# EAGLE schematic AK4493-v1.64_24 (EAGLE 9.6.2)
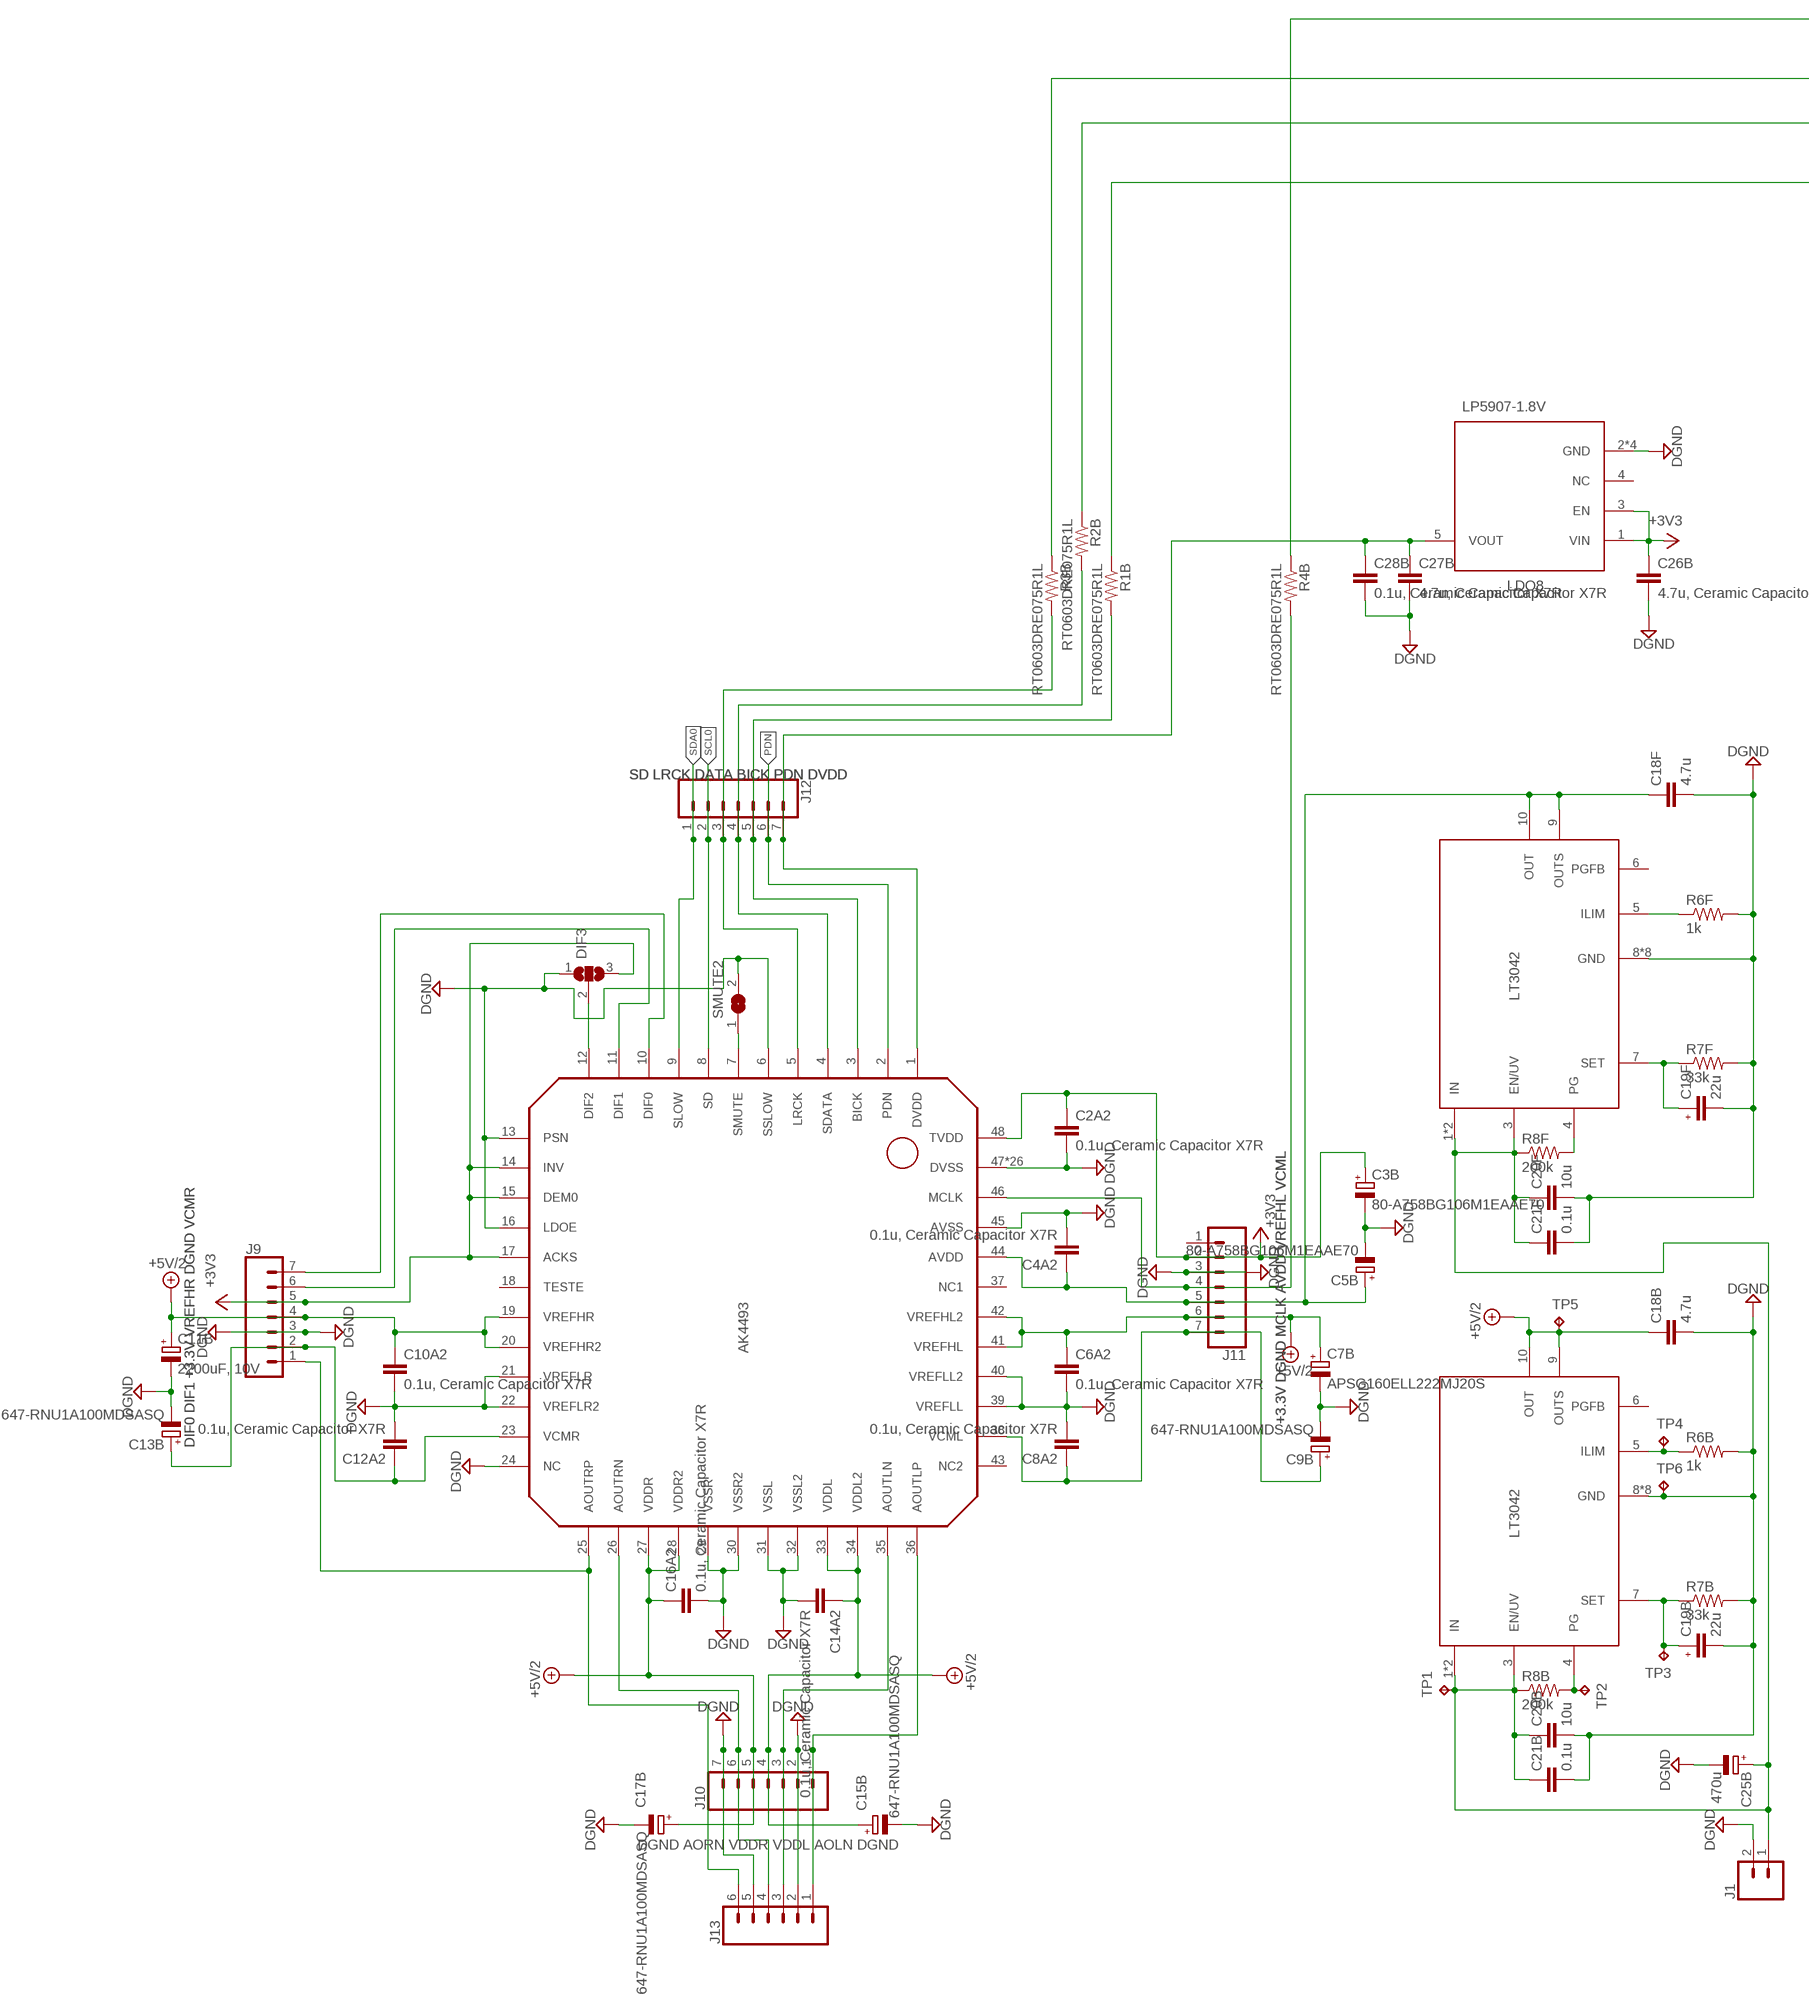
[diagram p0: schematic, sheet 1, part 1 of 2]
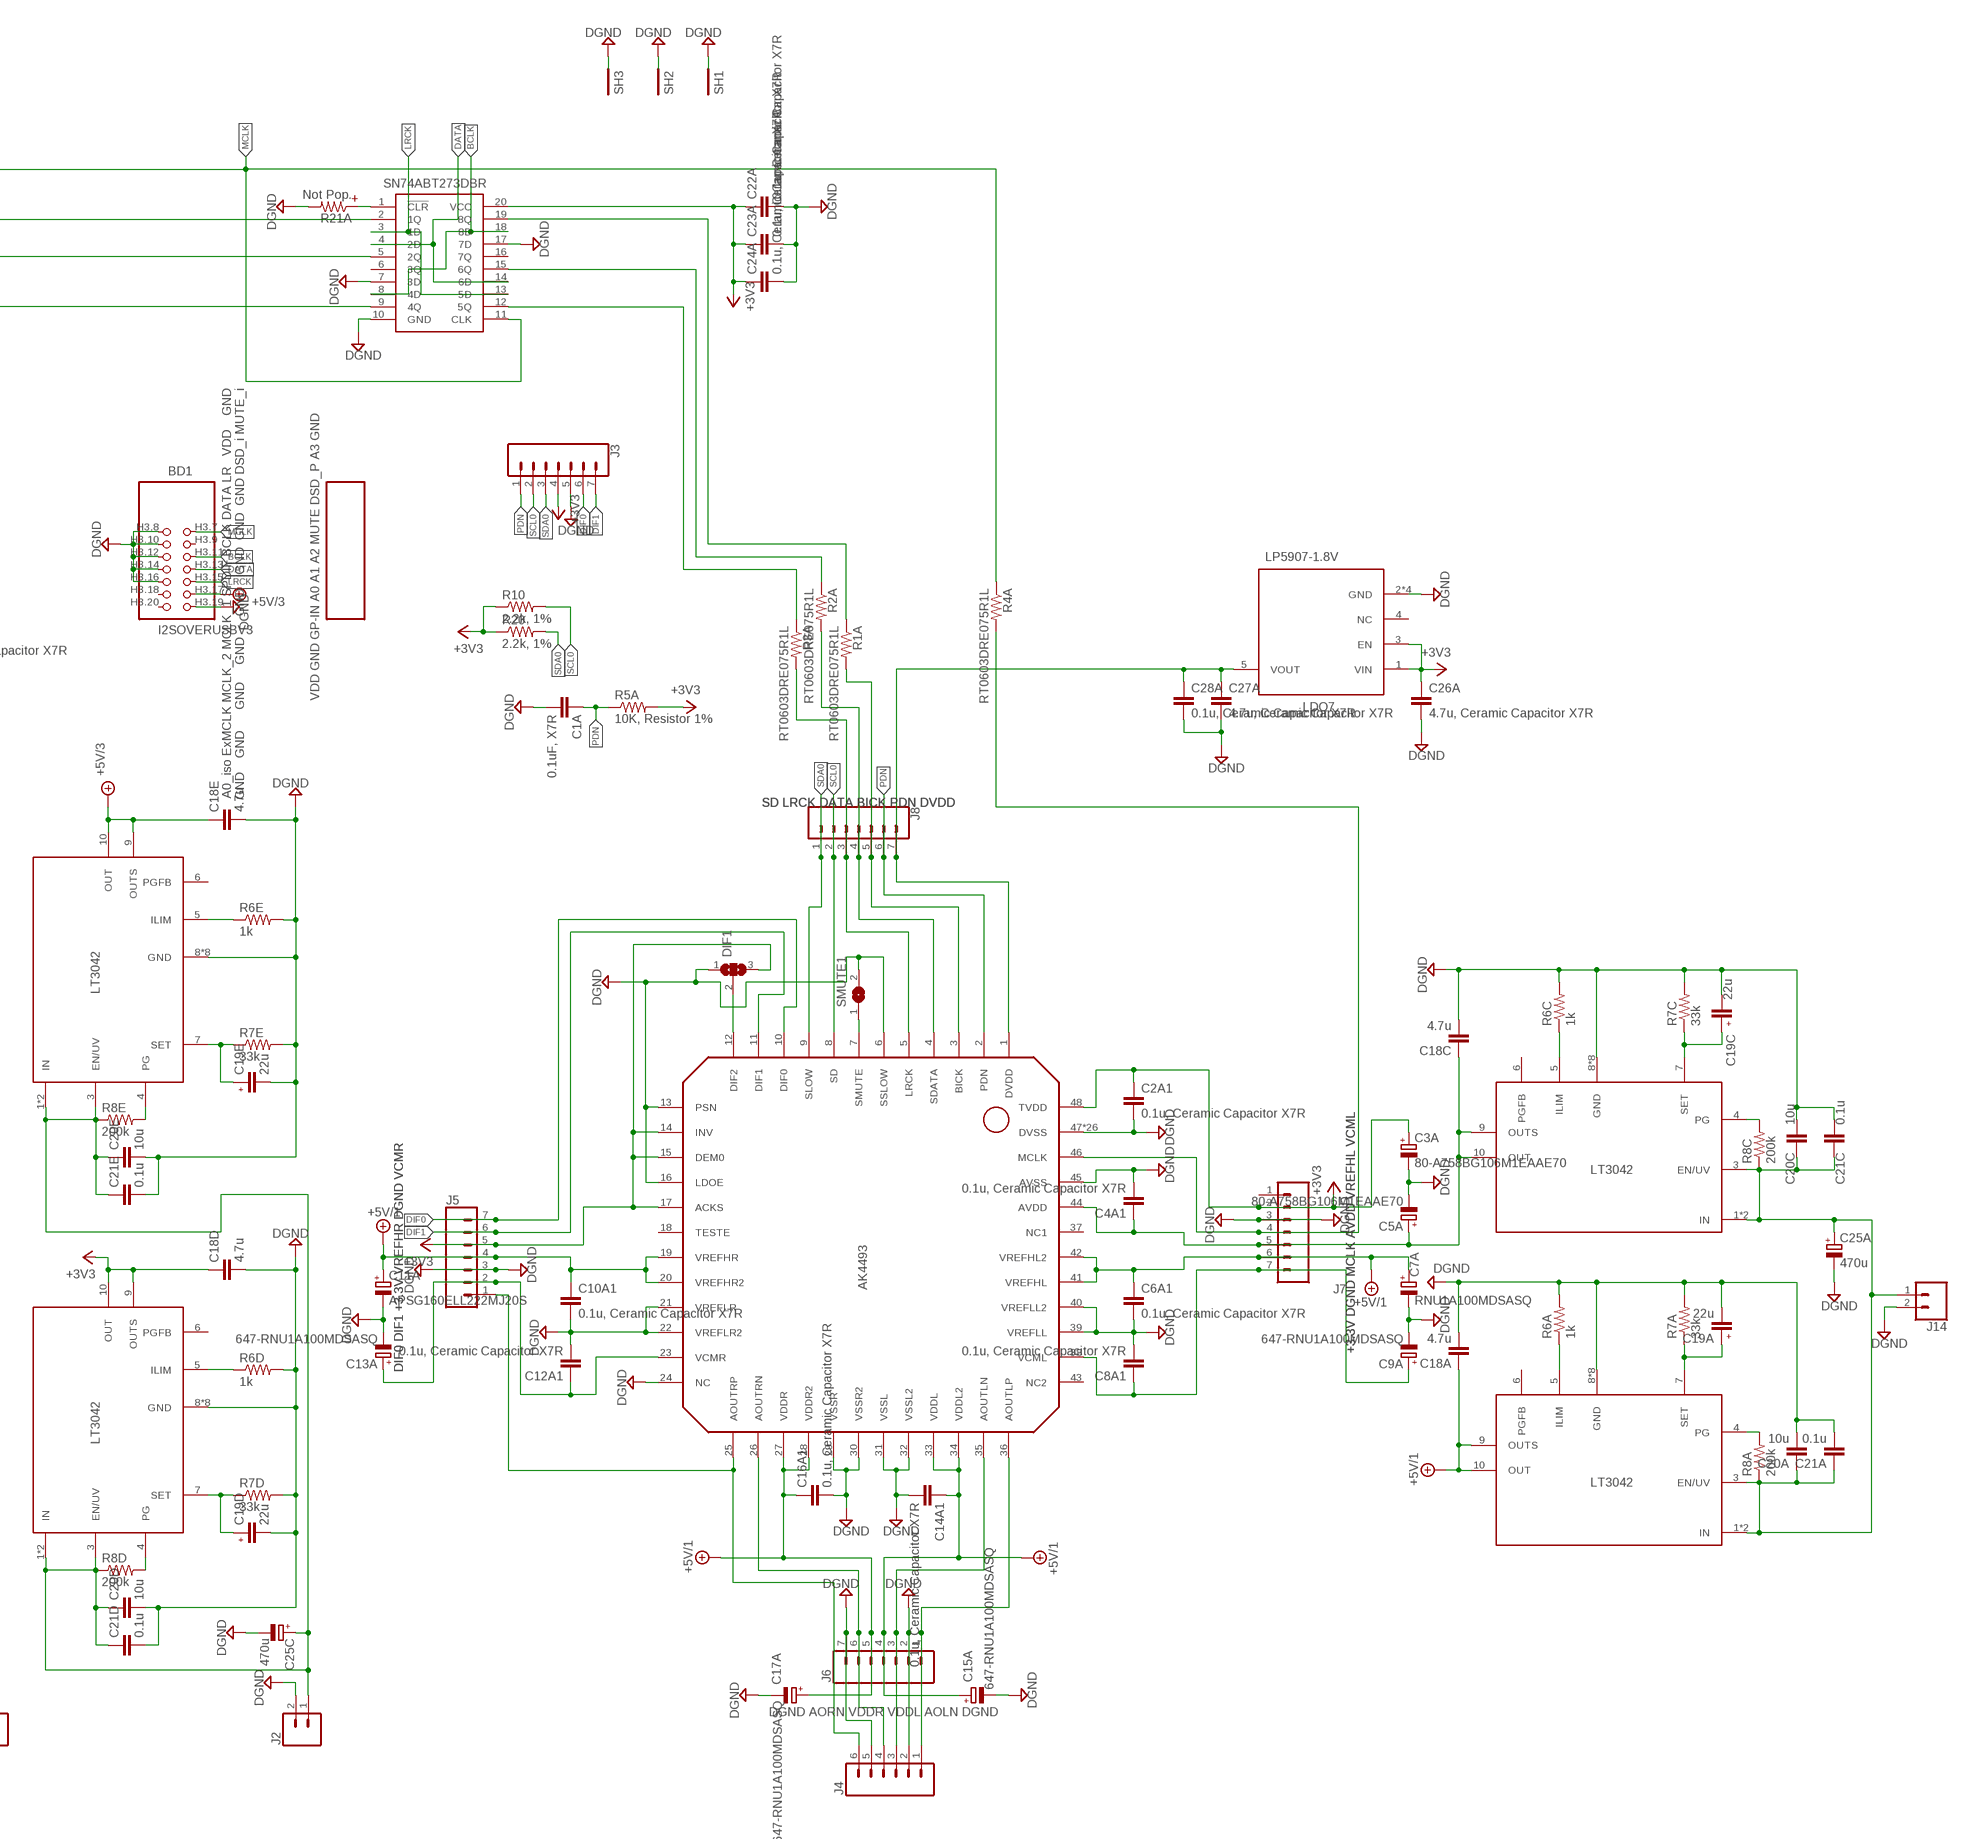
[diagram p1: schematic, sheet 1, part 2 of 2]

## Parts
BD1  I2SOVERUSBV3  [I2SOVERUSBV3]
C1A  0.1uF, X7R  EMF212B7104KGHT  [CAPC2012X135N]
C2A1  0.1u, Ceramic Capacitor X7R  EMK107B7104KA-T  [CAPC1608X95N]
C2A2  0.1u, Ceramic Capacitor X7R  EMK107B7104KA-T  [CAPC1608X95N]
C3A  80-A758BG106M1EAAE70  RNU1A100MDSASQ  [CAPPRD150W45D450H600]
C3B  80-A758BG106M1EAAE70  A758BG106M1EAAE070  [CAPPRD200W55D500H800]
C4A1  0.1u, Ceramic Capacitor X7R  EMK107B7104KA-T  [CAPC1608X95N]
C4A2  0.1u, Ceramic Capacitor X7R  EMK107B7104KA-T  [CAPC1608X95N]
C5A  80-A758BG106M1EAAE70  A758BG106M1EAAE070  [CAPPRD200W55D500H800]
C5B  80-A758BG106M1EAAE70  A758BG106M1EAAE070  [CAPPRD200W55D500H800]
C6A1  0.1u, Ceramic Capacitor X7R  EMK107B7104KA-T  [CAPC1608X95N]
C6A2  0.1u, Ceramic Capacitor X7R  EMK107B7104KA-T  [CAPC1608X95N]
C7A  RNU1A100MDSASQ  [CAPPRD150W45D450H600]
C7B  APSG160ELL222MJ20S  [CAPPRD500W60D1025H2150]
C8A1  0.1u, Ceramic Capacitor X7R  EMK107B7104KA-T  [CAPC1608X95N]
C8A2  0.1u, Ceramic Capacitor X7R  EMK107B7104KA-T  [CAPC1608X95N]
C9A  647-RNU1A100MDSASQ  RNU1A100MDSASQ  [CAPPRD150W45D450H600]
C9B  647-RNU1A100MDSASQ  RNU1A100MDSASQ  [CAPPRD150W45D450H600]
C10A1  0.1u, Ceramic Capacitor X7R  EMK107B7104KA-T  [CAPC1608X95N]
C10A2  0.1u, Ceramic Capacitor X7R  EMK107B7104KA-T  [CAPC1608X95N]
C11A  APSG160ELL222MJ20S  [CAPPRD500W60D1025H2150]
C11B  2200uF, 10V  APSG160ELL222MJ20S  [CAPPRD500W60D1025H2150]
C12A1  0.1u, Ceramic Capacitor X7R  EMK107B7104KA-T  [CAPC1608X95N]
C12A2  0.1u, Ceramic Capacitor X7R  EMK107B7104KA-T  [CAPC1608X95N]
C13A  647-RNU1A100MDSASQ  RNU1A100MDSASQ  [CAPPRD150W45D450H600]
C13B  647-RNU1A100MDSASQ  RNU1A100MDSASQ  [CAPPRD150W45D450H600]
C14A1  0.1u, Ceramic Capacitor X7R  EMK107B7104KA-T  [CAPC1608X95N]
C14A2  0.1u, Ceramic Capacitor X7R  EMK107B7104KA-T  [CAPC1608X95N]
C15A  647-RNU1A100MDSASQ  RNU1A100MDSASQ  [CAPPRD150W45D450H600]
C15B  647-RNU1A100MDSASQ  RNU1A100MDSASQ  [CAPPRD150W45D450H600]
C16A1  0.1u, Ceramic Capacitor X7R  EMK107B7104KA-T  [CAPC1608X95N]
C16A2  0.1u, Ceramic Capacitor X7R  EMK107B7104KA-T  [CAPC1608X95N]
C17A  647-RNU1A100MDSASQ  RNU1A100MDSASQ  [CAPPRD150W45D450H600]
C17B  647-RNU1A100MDSASQ  RNU1A100MDSASQ  [CAPPRD150W45D450H600]
C18A  4.7u  EMK212ABJ475KG-T  [CAPC2013X140N]
C18B  4.7u  EMK212ABJ475KG-T  [CAPC2013X140N]
C18C  4.7u  EMK212ABJ475KG-T  [CAPC2013X140N]
C18D  4.7u  EMK212ABJ475KG-T  [CAPC2013X140N]
C18E  4.7u  EMK212ABJ475KG-T  [CAPC2013X140N]
C18F  4.7u  EMK212ABJ475KG-T  [CAPC2013X140N]
C19A  22u  EMK316BB7226ML-T  [C1206]
C19B  22u  EMK316BB7226ML-T  [C1206]
C19C  22u  EMK316BB7226ML-T  [C1206]
C19D  22u  EMK316BB7226ML-T  [C1206]
C19E  22u  EMK316BB7226ML-T  [C1206]
C19F  22u  EMK316BB7226ML-T  [C1206]
C20A  10u  EMK212BB7106KG-T  [CAPC2012X135N]
C20B  10u  EMK212BB7106KG-T  [CAPC2012X135N]
C20C  10u  EMK212BB7106KG-T  [CAPC2012X135N]
C20D  10u  EMK212BB7106KG-T  [CAPC2012X135N]
C20E  10u  EMK212BB7106KG-T  [CAPC2012X135N]
C20F  10u  EMK212BB7106KG-T  [CAPC2012X135N]
C21A  0.1u  EMF212B7104KGHT  [CAPC2012X135N]
C21B  0.1u  EMF212B7104KGHT  [CAPC2012X135N]
C21C  0.1u  EMF212B7104KGHT  [CAPC2012X135N]
C21D  0.1u  EMF212B7104KGHT  [CAPC2012X135N]
C21E  0.1u  EMF212B7104KGHT  [CAPC2012X135N]
C21F  0.1u  EMF212B7104KGHT  [CAPC2012X135N]
C22A  0.1u, Ceramic Capacitor X7R  EMF212B7104KGHT  [CAPC2012X135N]
C23A  0.1u, Ceramic Capacitor X7R  EMF212B7104KGHT  [CAPC2012X135N]
C24A  0.1u, Ceramic Capacitor X7R  EMF212B7104KGHT  [CAPC2012X135N]
C25A  470u  RNE1C471MDN1  [CAPPRD350W60D825H1300]
C25B  470u  RNE1C471MDN1  [CAPPRD350W60D825H1300]
C25C  470u  RNE1C471MDN1  [CAPPRD350W60D825H1300]
C26A  4.7u, Ceramic Capacitor X7R  EMK212ABJ475KG-T  [CAPC2013X140N]
C26B  4.7u, Ceramic Capacitor X7R  EMK212ABJ475KG-T  [CAPC2013X140N]
C27A  4.7u, Ceramic Capacitor X7R  EMK212ABJ475KG-T  [CAPC2013X140N]
C27B  4.7u, Ceramic Capacitor X7R  EMK212ABJ475KG-T  [CAPC2013X140N]
C28A  0.1u, Ceramic Capacitor X7R  EMF212B7104KGHT  [CAPC2012X135N]
C28B  0.1u, Ceramic Capacitor X7R  EMF212B7104KGHT  [CAPC2012X135N]
DIF1  SJ2W  [SJ_2]
DIF3  SJ2W  [SJ_2]
IC2  AK4493  [LQFP48_]
IC3  AK4493  [LQFP48_]
IC4A  SN74ABT273DBR  [SOP65P780X200-20N]
J1  CONN_02  [1X02]
J2  CONN_02  [1X02]
J3  CONN_07  [1X07]
J4  CONN_06SILK_FEMALE_PTH  [1X06]
J5  CONN_07  [1X07]
J6  CONN_07  [1X07]
J7  CONN_07  [1X07]
J8  CONN_07  [1X07]
J9  CONN_07  [1X07]
J10  CONN_07  [1X07]
J11  CONN_07  [1X07]
J12  CONN_07  [1X07]
J13  CONN_06SILK_FEMALE_PTH  [1X06]
J14  CONN_02  [1X02]
LDO1  LT3042  [SOP50P490X110-11N]
LDO2  LT3042  [SOP50P490X110-11N]
LDO3  LT3042  [SOP50P490X110-11N]
LDO4  LT3042  [SOP50P490X110-11N]
LDO5  LT3042  [SOP50P490X110-11N]
LDO6  LT3042  [SOP50P490X110-11N]
LDO7  LP5907-1.8V  [SOT95P280X145-5N]
LDO8  LP5907-1.8V  [SOT95P280X145-5N]
R1A  RT0603DRE075R1L  [RESC1608X55N]
R1B  RT0603DRE075R1L  [RESC1608X55N]
R2A  RT0603DRE075R1L  [RESC1608X55N]
R2B  RT0603DRE075R1L  [RESC1608X55N]
R3A  RT0603DRE075R1L  [RESC1608X55N]
R3B  RT0603DRE075R1L  [RESC1608X55N]
R4A  RT0603DRE075R1L  [RESC1608X55N]
R4B  RT0603DRE075R1L  [RESC1608X55N]
R5A  10K, Resistor 1%  RCS080510K0FKEA  [RESC2012X50N]
R6A  1k  CHP0805-FX-1001ELF  [RESC2012X60N]
R6B  1k  CHP0805-FX-1001ELF  [RESC2012X60N]
R6C  1k  CHP0805-FX-1001ELF  [RESC2012X60N]
R6D  1k  CHP0805-FX-1001ELF  [RESC2012X60N]
R6E  1k  CHP0805-FX-1001ELF  [RESC2012X60N]
R6F  1k  CHP0805-FX-1001ELF  [RESC2012X60N]
R7A  33k  CPF0805B51KE1  [R0805]
R7B  33k  CPF0805B51KE1  [R0805]
R7C  33k  CPF0805B51KE1  [R0805]
R7D  33k  CPF0805B51KE1  [R0805]
R7E  33k  CPF0805B51KE1  [R0805]
R7F  33k  CPF0805B51KE1  [R0805]
R8A  200k  RR1220P-204-D  [R0805]
R8B  200k  RR1220P-204-D  [R0805]
R8C  200k  RR1220P-204-D  [R0805]
R8D  200k  RR1220P-204-D  [R0805]
R8E  200k  RR1220P-204-D  [R0805]
R8F  200k  RR1220P-204-D  [R0805]
R10  2.2k, 1%  RCS08052K20FKEA  [RCS0805_E3]
R20  2.2k, 1%  RCS08052K20FKEA  [RCS0805_E3]
R21A  Not Pop.  R-POLR0805  [R0805-POL]
SH1  SHORTA5  [SHORT_ALL-50]
SH2  SHORTA5  [SHORT_ALL-50]
SH3  SHORTA5  [SHORT_ALL-50]
SMUTE1  SJ  [SJ]
SMUTE2  SJ  [SJ]
TP1  TPB1,27  [B1,27]
TP2  TPB1,27  [B1,27]
TP3  TPB1,27  [B1,27]
TP4  TPB1,27  [B1,27]
TP5  TPB1,27  [B1,27]
TP6  TPB1,27  [B1,27]

## Nets
+3V3: C2A1.1 C2A2.1 C3A.1(+) C3B.1(+) C18D.1 C22A.1 C23A.1 C24A.1 C26A.1 C26B.1 DIF1.3 DIF3.3 IC2.14(INV) IC2.15(DEM0) IC2.17(ACKS) IC2.48(TVDD) IC3.14(INV) IC3.15(DEM0) IC3.17(ACKS) IC3.48(TVDD) IC4A.20(VCC) J3.4 J5.5 J7.2 J9.5 J11.2 LDO4.9(OUTS) LDO4.10(OUT) LDO7.1(VIN) LDO7.3(EN) LDO8.1(VIN) LDO8.3(EN) R5A.2 R10.1 R20.1
+5V/1: C6A1.1 C7A.1(+) C10A1.1 C11A.1(+) C14A1.1 C15A.1(+) C16A1.1 C17A.1(+) C18A.1 IC2.19(VREFHR) IC2.20(VREFHR2) IC2.27(VDDR) IC2.28(VDDR2) IC2.33(VDDL) IC2.34(VDDL2) IC2.41(VREFHL) IC2.42(VREFHL2) J5.4 J6.4 J6.5 J7.6 LDO1.9(OUTS) LDO1.10(OUT)
+5V/2: C6A2.1 C7B.1(+) C10A2.1 C11B.1(+) C14A2.1 C15B.1(+) C16A2.1 C17B.1(+) C18B.1 IC3.19(VREFHR) IC3.20(VREFHR2) IC3.27(VDDR) IC3.28(VDDR2) IC3.33(VDDL) IC3.34(VDDL2) IC3.41(VREFHL) IC3.42(VREFHL2) J9.4 J10.4 J10.5 J11.6 LDO2.9(OUTS) LDO2.10(OUT) TP5.TP
+5V/3: BD1.H3.17 C18E.1 LDO5.9(OUTS) LDO5.10(OUT)
BCLK: BD1.H3.11 IC4A.8(4D) IC4A.18(8D)
DATA: BD1.H3.13 IC4A.4(2D) IC4A.14(6D)
DGND: BD1.H3.8 BD1.H3.10 BD1.H3.12 BD1.H3.14 BD1.H3.16 BD1.H3.19 C1A.2 C2A1.2 C2A2.2 C3A.2(-) C3B.2(-) C4A1.2 C4A2.2 C5A.2(-) C5B.2(-) C6A1.2 C6A2.2 C7A.2(-) C7B.2(-) C8A1.2 C8A2.2 C9A.2(-) C9B.2(-) C10A1.2 C10A2.2 C11A.2(-) C11B.2(-) C12A1.2 C12A2.2 C13A.2(-) C13B.2(-) C14A1.2 C14A2.2 C15A.2(-) C15B.2(-) C16A1.2 C16A2.2 C17A.2(-) C17B.2(-) C18A.2 C18B.2 C18C.2 C18D.2 C18E.2 C18F.2 C19A.2 C19A.DGND C19B.2 C19B.DGND C19C.2 C19C.DGND C19D.2 C19D.DGND C19E.2 C19E.DGND C19F.2 C19F.DGND C20A.2 C20B.2 C20C.2 C20D.2 C20E.2 C20F.2 C21A.2 C21B.2 C21C.2 C21D.2 C21E.2 C21F.2 C22A.2 C23A.2 C24A.2 C25A.2(-) C25B.2(-) C25C.2(-) C26A.2 C26B.2 C27A.2 C27B.2 C28A.2 C28B.2 DIF1.1 DIF3.1 IC2.6(SSLOW) IC2.13(PSN) IC2.16(LDOE) IC2.21(VREFLR) IC2.22(VREFLR2) IC2.24(NC) IC2.29(VSSR) IC2.30(VSSR2) IC2.31(VSSL) IC2.32(VSSL2) IC2.39(VREFLL) IC2.40(VREFLL2) IC2.45(AVSS) IC2.47(DVSS) IC2.P$1(DVSS) IC2.P$2(DVSS) IC2.P$3(DVSS) IC2.P$4(DVSS) IC2.P$5(DVSS) IC2.P$6(DVSS) IC2.P$7(DVSS) IC2.P$8(DVSS) IC2.P$9(DVSS) IC2.P$10(DVSS) IC2.P$11(DVSS) IC2.P$12(DVSS) IC2.P$13(DVSS) IC2.P$14(DVSS) IC2.P$15(DVSS) IC2.P$16(DVSS) IC2.P$17(DVSS) IC2.P$18(DVSS) IC2.P$19(DVSS) IC2.P$20(DVSS) IC2.P$21(DVSS) IC2.P$22(DVSS) IC2.P$23(DVSS) IC2.P$24(DVSS) IC2.P$25(DVSS) IC3.6(SSLOW) IC3.13(PSN) IC3.16(LDOE) IC3.21(VREFLR) IC3.22(VREFLR2) IC3.24(NC) IC3.29(VSSR) IC3.30(VSSR2) IC3.31(VSSL) IC3.32(VSSL2) IC3.39(VREFLL) IC3.40(VREFLL2) IC3.45(AVSS) IC3.47(DVSS) IC3.P$1(DVSS) IC3.P$2(DVSS) IC3.P$3(DVSS) IC3.P$4(DVSS) IC3.P$5(DVSS) IC3.P$6(DVSS) IC3.P$7(DVSS) IC3.P$8(DVSS) IC3.P$9(DVSS) IC3.P$10(DVSS) IC3.P$11(DVSS) IC3.P$12(DVSS) IC3.P$13(DVSS) IC3.P$14(DVSS) IC3.P$15(DVSS) IC3.P$16(DVSS) IC3.P$17(DVSS) IC3.P$18(DVSS) IC3.P$19(DVSS) IC3.P$20(DVSS) IC3.P$21(DVSS) IC3.P$22(DVSS) IC3.P$23(DVSS) IC3.P$24(DVSS) IC3.P$25(DVSS) IC4A.7(3D) IC4A.10(GND) IC4A.17(7D) J1.2 J2.2 J3.5 J4.2 J4.5 J5.3 J6.2 J6.7 J7.3 J9.3 J10.2 J10.7 J11.3 J13.2 J13.5 J14.2 LDO1.8(GND) LDO1.11(GND) LDO1.P$1(GND) LDO1.P$2(GND) LDO1.P$3(GND) LDO1.P$4(GND) LDO1.P$5(GND) LDO1.P$6(GND) LDO2.8(GND) LDO2.11(GND) LDO2.P$1(GND) LDO2.P$2(GND) LDO2.P$3(GND) LDO2.P$4(GND) LDO2.P$5(GND) LDO2.P$6(GND) LDO3.8(GND) LDO3.11(GND) LDO3.P$1(GND) LDO3.P$2(GND) LDO3.P$3(GND) LDO3.P$4(GND) LDO3.P$5(GND) LDO3.P$6(GND) LDO4.8(GND) LDO4.11(GND) LDO4.P$1(GND) LDO4.P$2(GND) LDO4.P$3(GND) LDO4.P$4(GND) LDO4.P$5(GND) LDO4.P$6(GND) LDO5.8(GND) LDO5.11(GND) LDO5.P$1(GND) LDO5.P$2(GND) LDO5.P$3(GND) LDO5.P$4(GND) LDO5.P$5(GND) LDO5.P$6(GND) LDO6.8(GND) LDO6.11(GND) LDO6.P$1(GND) LDO6.P$2(GND) LDO6.P$3(GND) LDO6.P$4(GND) LDO6.P$5(GND) LDO6.P$6(GND) LDO7.2(GND) LDO7.DGND2(GND) LDO7.DGND3(GND) LDO7.DGND(GND) LDO8.2(GND) LDO8.DGND2(GND) LDO8.DGND3(GND) LDO8.DGND(GND) R6A.2 R6B.2 R6C.2 R6D.2 R6E.2 R6F.2 R7A.2 R7B.2 R7C.2 R7D.2 R7E.2 R7F.2 R21A.2 R21A.DGND SH1.1 SH2.1 SH3.1 SMUTE1.2 SMUTE2.2 TP6.TP
DIF0: IC2.10(DIF0) J3.6 J5.7
DIF1: IC2.11(DIF1) J3.7 J5.6
LRCK: BD1.H3.15 IC4A.3(1D) IC4A.13(5D)
MCLK: BD1.H3.7 IC4A.11(CLK) R4A.1 R4B.1
N$1: IC4A.1(!CLR) R21A.1
N$2: C8A2.1 C9B.1(+) IC3.38(VCML) J11.7
N$4: C4A1.1 C5A.1(+) C18C.1 IC2.44(AVDD) J7.5 LDO3.9(OUTS) LDO3.10(OUT)
N$5: LDO3.5(ILIM) R6C.1
N$6: LDO4.5(ILIM) R6D.1
N$7: C19D.1 LDO4.7(SET) R7D.1
N$8: LDO4.4(PG) R8D.2
N$9: LDO5.5(ILIM) R6E.1
N$10: C19E.1 LDO5.7(SET) R7E.1
N$11: IC3.46(MCLK) J11.4 R4B.2
N$13: LDO5.4(PG) R8E.2
N$14: C20D.1 C20E.1 C21D.1 C21E.1 C25C.1(+) J2.1 LDO4.1(IN) LDO4.2(IN) LDO4.3(EN/UV) LDO5.1(IN) LDO5.2(IN) LDO5.3(EN/UV) R8D.1 R8E.1
N$15: LDO1.5(ILIM) R6A.1
N$19: IC2.5(LRCK) J8.3 R3A.2
N$20: IC2.4(SDATA) J8.4 R2A.2
N$21: IC2.3(BICK) J8.5 R1A.2
N$22: C19A.1 LDO1.7(SET) R7A.1
N$23: IC4A.19(8Q) R1A.1
N$24: IC4A.15(6Q) R2A.1
N$25: IC4A.12(5Q) R3A.1
N$26 [R_Audio]: IC2.26(AOUTRN) J4.4 J6.6
N$27: IC3.3(BICK) J12.5 R1B.2
N$28: IC3.4(SDATA) J12.4 R2B.2
N$29: IC3.5(LRCK) J12.3 R3B.2
N$30: IC4A.9(4Q) R1B.1
N$31: IC4A.5(2Q) R2B.1
N$32: IC4A.2(1Q) R3B.1
N$33: LDO1.4(PG) R8A.2
N$35: LDO6.5(ILIM) R6F.1
N$36: C19F.1 LDO6.7(SET) R7F.1
N$37: C27A.1 C28A.1 IC2.1(DVDD) J8.7 LDO7.5(VOUT)
N$39: LDO6.4(PG) R8F.2
N$40: C20A.1 C20C.1 C21A.1 C21C.1 C25A.1(+) J14.1 LDO1.1(IN) LDO1.2(IN) LDO1.3(EN/UV) LDO3.1(IN) LDO3.2(IN) LDO3.3(EN/UV) R8A.1 R8C.1
N$42: C4A2.1 C5B.1(+) C18F.1 IC3.44(AVDD) J11.5 LDO6.9(OUTS) LDO6.10(OUT)
N$43: C19C.1 LDO3.7(SET) R7C.1
N$44: LDO3.4(PG) R8C.2
N$48: LDO2.5(ILIM) R6B.1 TP4.TP
N$49: C19B.1 LDO2.7(SET) R7B.1 TP3.TP
N$50: LDO2.4(PG) R8B.2 TP2.TP
N$51: C20B.1 C20F.1 C21B.1 C21F.1 C25B.1(+) J1.1 LDO2.1(IN) LDO2.2(IN) LDO2.3(EN/UV) LDO6.1(IN) LDO6.2(IN) LDO6.3(EN/UV) R8B.1 R8F.1 TP1.TP
N$66: C27B.1 C28B.1 IC3.1(DVDD) J12.7 LDO8.5(VOUT)
N$69: C12A1.1 C13A.1(+) IC2.23(VCMR) J5.2
N$79: IC3.36(AOUTLP) J10.1 J13.1
N$80: IC3.25(AOUTRP) J9.1 J13.6
N$81: IC3.10(DIF0) J9.7
N$82 [L_Audio]: IC2.36(AOUTLP) J4.1 J6.1
N$83 [L_Audio]: IC2.35(AOUTLN) J4.3 J6.3
N$87: IC3.35(AOUTLN) J10.3 J13.3
N$88: IC3.26(AOUTRN) J10.6 J13.4
N$90: IC2.25(AOUTRP) J4.6 J5.1
N$96: IC2.46(MCLK) J7.4 R4A.2
N$101: C12A2.1 C13B.1(+) IC3.23(VCMR) J9.2
N$102: C8A1.1 C9A.1(+) IC2.38(VCML) J7.7
N$105: DIF1.2 IC2.12(DIF2)
N$106: IC2.7(SMUTE) SMUTE1.1
N$107: DIF3.2 IC3.12(DIF2)
N$114: IC3.7(SMUTE) SMUTE2.1
N$116: IC3.11(DIF1) J9.6
PDN: C1A.1 IC2.2(PDN) IC3.2(PDN) J3.1 J8.6 J12.6 R5A.1
SCL0: IC2.8(SD) IC3.8(SD) J3.2 J8.2 J12.2 R10.2
SDA0: IC2.9(SLOW) IC3.9(SLOW) J3.3 J8.1 J12.1 R20.2
Unconnected: BD1.H3.9 BD1.H3.18 BD1.H3.20 IC2.18(TESTE) IC2.37(NC1) IC2.43(NC2) IC3.18(TESTE) IC3.37(NC1) IC3.43(NC2) IC4A.6(3Q) IC4A.16(7Q) J7.1 J11.1 LDO1.6(PGFB) LDO2.6(PGFB) LDO3.6(PGFB) LDO4.6(PGFB) LDO5.6(PGFB) LDO6.6(PGFB) LDO7.4(NC) LDO8.4(NC) SH1.2 SH2.2 SH3.2

## Notes on the sheet
- SD LRCK DATA BICK PDN DVDD | SD LRCK DATA BICK PDN DVDD | SD LRCK DATA BICK PDN DVDD | SD LRCK DATA BICK PDN DVDD
- +3.3V DGND MCLK AVDD VREFHL VCML | +3.3V DGND MCLK AVDD VREFHL VCML | +3.3V DGND MCLK AVDD VREFHL VCML | +3.3V DGND MCLK AVDD VREFHL VCML
- DIF0 DIF1 +3.3V VREFHR DGND VCMR | DIF0 DIF1 +3.3V VREFHR DGND VCMR | DIF0 DIF1 +3.3V VREFHR DGND VCMR | DIF0 DIF1 +3.3V VREFHR DGND VCMR
- DGND AORN VDDR VDDL AOLN DGND
- DGND AORN VDDR VDDL AOLN DGND

## Library data of the parts
BD1 = Dual Mono Amp Library:I2SOVERUSBV3: Asynchronous audio transfer at sampling rates up to 768 kHz and 32 bit; BOM: Yes; DESCRIPTION: Asynchronous audio transfer at sampling rates up to 768 kHz and 32 bit
C1A C21A C21B C21C C21D C21E C21F C22A C23A C24A C28A C28B = Dual Mono Amp Library:EMF212B7104KGHT: Multilayer Ceramic Capacitors MLCC - SMD/SMT 0805 16VDC 0.1uF 10% X7R AEC-Q200 Source: Datasheet <https://www.mouser.sg/ProductDetail/Taiyo-Yuden/EMF212B7104KGHT?qs=sGAEpiMZZMsh%2B1woXyUXj3/0vCYPokIk61QdMFnXOfA=>; DESCRIPTION: Multilayer Ceramic Capacitors MLCC - SMD/SMT 0805 16VDC 0.1uF 10% X7R AEC-Q200; HEIGHT: 1.35mm; MANUFACTURER_NAME: TAIYO YUDEN; MANUFACTURER_PART_NUMBER: EMF212B7104KGHT; MOUSER_PART_NUMBER: 963-EMF212B7104KGHT; MOUSER_PRICE-STOCK: https://www.mouser.co.uk/ProductDetail/Taiyo-Yuden/EMF212B7104KGHT?qs=%252B6g0mu59x7JRGtoE3odDgw%3D%3D
C2A1 C2A2 C4A1 C4A2 C6A1 C6A2 C8A1 C8A2 C10A1 C10A2 C12A1 C12A2 C14A1 C14A2 C16A1 C16A2 = Dual Mono Amp Library:EMK107B7104KA-T: EMK107B7104KA-T 0.1F +/-10% 16V Ceramic Capacitor X7R 0603 Source: Datasheet; DESCRIPTION: EMK107B7104KA-T 0.1F +/-10% 16V Ceramic Capacitor X7R 0603; HEIGHT: 0.95mm; MANUFACTURER_NAME: TAIYO YUDEN; MANUFACTURER_PART_NUMBER: EMK107B7104KA-T; MOUSER_PART_NUMBER: 963-EMK107B7104KA-T; MOUSER_PRICE-STOCK: https://www.mouser.co.uk/ProductDetail/TAIYO-YUDEN/EMK107B7104KA-T?qs=I6KAKw0tg2ybqzX8hKPgfw%3D%3D
C3A C7A C9A C9B C13A C13B C15A C15B C17A C17B = Dual Mono Amp Library:RNU1A100MDSASQ: Aluminum Organic Polymer Capacitors 10 Volt 10uF 20% Source: Datasheet <https://www.nichicon.co.jp/products/pdfs/f_nu.pdf>; DESCRIPTION: Aluminum Organic Polymer Capacitors 10 Volt 10uF 20%; HEIGHT: 6mm; MANUFACTURER_NAME: Nichicon; MANUFACTURER_PART_NUMBER: RNU1A100MDSASQ; MOUSER_PART_NUMBER: 647-RNU1A100MDSASQ; MOUSER_PRICE-STOCK: https://www.mouser.co.uk/ProductDetail/Nichicon/RNU1A100MDSASQ?qs=eL6fcoQH66Plszdei%2FxZtw%3D%3D
C3B C5A C5B = Dual Mono Amp Library:A758BG106M1EAAE070: A758, Aluminum, Polymer Aluminum, 10 uF, 20%, 25 VDC, -55/+105C, 105C, -55C, 105C, 5,000 Hrs, 10 % , 70 mOhms, 120 uA, 5mm, 7mm, Lead Spacing = 2mm, 19mm, 1000 Source: Datasheet <https://content.kemet.com/datasheets/KEM_A4069_A758.pdf>; DESCRIPTION: A758, Aluminum, Polymer Aluminum, 10 uF, 20%, 25 VDC, -55/+105C, 105C, -55C, 105C, 5,000 Hrs, 10 % , 70 mOhms, 120 uA, 5mm, 7mm, Lead Spacing = 2mm, 19mm, 1000; HEIGHT: 8mm; MANUFACTURER_NAME: KEMET; MANUFACTURER_PART_NUMBER: A758BG106M1EAAE070; MOUSER_PART_NUMBER: 80-A758BG106M1EAAE70; MOUSER_PRICE-STOCK: https://www.mouser.co.uk/ProductDetail/KEMET/A758BG106M1EAAE070?qs=M6jHmRuQorU1WkHVIs6y3Q%3D%3D
C7B C11A C11B = Dual Mono Amp Library:APSG160ELL222MJ20S: Aluminum Organic Polymer Capacitors 16V 2200uF 20% Tol. Source: Datasheet <https://www.chemi-con.co.jp/products/relatedfiles/capacitor/catalog/PSGLL-e.PDF>; DESCRIPTION: Aluminum Organic Polymer Capacitors 16V 2200uF 20% Tol.; HEIGHT: 21.5mm; MANUFACTURER_NAME: Chemi-Con; MANUFACTURER_PART_NUMBER: APSG160ELL222MJ20S; MOUSER_PART_NUMBER: 661-APSG160E222MJ20S; MOUSER_PRICE-STOCK: https://www.mouser.co.uk/ProductDetail/United-Chemi-Con/APSG160ELL222MJ20S?qs=nxZbHzLpdvcUAIXRVD5aZg%3D%3D
C18A C18B C18C C18D C18E C18F C26A C26B C27A C27B = Dual Mono Amp Library:EMK212ABJ475KG-T: Taiyo Yuden 4.7uF Multilayer Ceramic Capacitor MLCC 16V dc +/-10% X5R Dielectric 0805 SMD, Max. Temp. +85C Source: Datasheet <https://datasheet.datasheetarchive.com/originals/distributors/DKDS-8/141347.pdf>; DESCRIPTION: Taiyo Yuden 4.7uF Multilayer Ceramic Capacitor MLCC 16V dc +/-10% X5R Dielectric 0805 SMD, Max. Temp. +85C; HEIGHT: 1.4mm; MANUFACTURER_NAME: TAIYO YUDEN; MANUFACTURER_PART_NUMBER: EMK212ABJ475KG-T; MOUSER_PART_NUMBER: 963-EMK212ABJ475KG-T; MOUSER_PRICE-STOCK: https://www.mouser.co.uk/ProductDetail/Taiyo-Yuden/EMK212ABJ475KG-T?qs=Va%252BXcMGJzEtDqSLhA2RQmA%3D%3D
C19A C19B C19C C19D C19E C19F = Dual Mono Amp Library:EMK316BB7226ML-T: Multilayer Ceramic Capacitors MLCC - SMD/SMT 22uF 16V X7R +/-20% 1206 Gen Purp Source: Datasheet <https://componentsearchengine.com/Datasheets/1/EMK316BB7226ML-T.pdf>; DESCRIPTION: Multilayer Ceramic Capacitors MLCC - SMD/SMT 22uF 16V X7R +/-20% 1206 Gen Purp; HEIGHT: 1.8mm; MANUFACTURER_NAME: TAIYO YUDEN; MANUFACTURER_PART_NUMBER: EMK316BB7226ML-T; MOUSER_PART_NUMBER: 963-EMK316BB7226ML-T; MOUSER_PRICE-STOCK: https://www.mouser.co.uk/ProductDetail/TAIYO-YUDEN/EMK316BB7226ML-T?qs=EPmvyOv1YlPvyo1ebMxtFg%3D%3D
C20A C20B C20C C20D C20E C20F = Dual Mono Amp Library:EMK212BB7106KG-T: Multilayer Ceramic Capacitors MLCC - SMD/SMT 10uF 16V X7R 10% 0805 Source: Datasheet; DESCRIPTION: Multilayer Ceramic Capacitors MLCC - SMD/SMT 10uF 16V X7R 10% 0805; HEIGHT: 1.35mm; MANUFACTURER_NAME: TAIYO YUDEN; MANUFACTURER_PART_NUMBER: EMK212BB7106KG-T; MOUSER_PART_NUMBER: 963-EMK212BB7106KG-T; MOUSER_PRICE-STOCK: https://www.mouser.co.uk/ProductDetail/TAIYO-YUDEN/EMK212BB7106KG-T?qs=vF%252B8ahGVilemLVRka0hELA%3D%3D
C25A C25B C25C = Dual Mono Amp Library:RNE1C471MDN1: Cap Aluminum Polymer 470uF 16VDC 20% (8 X 11.5mm) Radial 3.5mm 0.01 Ohm 5400mA 2000h 105C Bulk Source: Datasheet <https://g.componentsearchengine.com/Datasheets/1/RNE1C471MDN1.pdf>; DESCRIPTION: Cap Aluminum Polymer 470uF 16VDC 20% (8 X 11.5mm) Radial 3.5mm 0.01 Ohm 5400mA 2000h 105C Bulk; HEIGHT: 13mm; MANUFACTURER_NAME: Nichicon; MANUFACTURER_PART_NUMBER: RNE1C471MDN1; MOUSER_PART_NUMBER: 647-RNE1C471MDN; MOUSER_PRICE-STOCK: https://www.mouser.co.uk/ProductDetail/Nichicon/RNE1C471MDN1?qs=3cDLNOBdYaXMZQrMc3zVvg%3D%3D
DIF1 DIF3 = Dual Mono Amp Library:SJ2W: SMD solder JUMPER
IC2 IC3 = Dual Mono Amp Library:AK4493: Quality Oriented 32-Bit 2ch DAC 32-Bit, 768 kHz with VELVET SOUND
IC4A = Dual Mono Amp Library:SN74ABT273DBR: Octal Edge-Triggered D-Type Flip-Flops With Clear Source: Datasheet <http://www.ti.com/lit/gpn/sn74abt273>; DESCRIPTION: Octal Edge-Triggered D-Type Flip-Flops With Clear; HEIGHT: 2mm; MANUFACTURER_NAME: Texas Instruments; MANUFACTURER_PART_NUMBER: SN74ABT273DBR; MOUSER_PART_NUMBER: 595-SN74ABT273DBR; MOUSER_PRICE-STOCK: https://www.mouser.co.uk/ProductDetail/Texas-Instruments/SN74ABT273DBR?qs=X1HXWTtiZ0RWq%2Fv0JNOEpw%3D%3D
J1 J2 J14 = Dual Mono Amp Library:CONN_02: Multi connection point. Often used as Generic Header-pin footprint for 0.1 inch spaced/style header connections On any of the 0.1 inch spaced packages, you can populate with these: Break Away Headers - Straight <https://www.sparkfun.com/products/116> (PRT-00116) Break Away Male Headers - Right Angle <https://www.sparkfun.com/products/553> (PRT-00553) Female Headers <https://www.sparkfun.com/products/115> (PRT-00115) Break Away Headers - Machine Pin <https://www.sparkfun.com/products/117> (PRT-00117) Break Away Female Headers - Swiss Machine Pin <https://www.sparkfun.com/products/743> (PRT-00743) For SCREWTERMINALS and SPRING TERMINALS visit here: Screw Terimnals on SparkFun.com <https://www.sparkfun.com/search/results?term=Screw+Terminals> (5mm/3.5mm/2.54mm spacing) This device is also useful as a general connection point to wire up your design to another part of your project. Our various solder wires solder well into these plated through hole pads. Hook-Up Wire - Assortment (Stranded, 22 AWG) <https://www.sparkfun.com/products/11375> (PRT-11375) Hook-Up Wire - Assortment (Solid Core, 22 AWG) <https://www.sparkfun.com/products/11367> (PRT-11367) View the entire wire category on our website here <https://www.sparkfun.com/categories/141> Special notes: Molex polarized connector foot print use with: PRT-08233 with associated crimp pins and housings. 2.54_SCREWTERM for use with PRT-10571. 3.5mm Screw Terminal footprints for PRT-08084 5mm Screw Terminal footprints for use with PRT-08432
J3 J5-J12 = Dual Mono Amp Library:CONN_07: Multi connection point. Often used as Generic Header-pin footprint for 0.1 inch spaced/style header connections On any of the 0.1 inch spaced packages, you can populate with these: Break Away Headers - Straight <https://www.sparkfun.com/products/116> (PRT-00116) Break Away Male Headers - Right Angle <https://www.sparkfun.com/products/553> (PRT-00553) Female Headers <https://www.sparkfun.com/products/115> (PRT-00115) Break Away Headers - Machine Pin <https://www.sparkfun.com/products/117> (PRT-00117) Break Away Female Headers - Swiss Machine Pin <https://www.sparkfun.com/products/743> (PRT-00743) For SCREWTERMINALS and SPRING TERMINALS visit here: Screw Terimnals on SparkFun.com <https://www.sparkfun.com/search/results?term=Screw+Terminals> (5mm/3.5mm/2.54mm spacing) This device is also useful as a general connection point to wire up your design to another part of your project. Our various solder wires solder well into these plated through hole pads. Hook-Up Wire - Assortment (Stranded, 22 AWG) <https://www.sparkfun.com/products/11375> (PRT-11375) Hook-Up Wire - Assortment (Solid Core, 22 AWG) <https://www.sparkfun.com/products/11367> (PRT-11367) View the entire wire category on our website here <https://www.sparkfun.com/categories/141> Special notes: Molex polarized connector foot print use with SKU : PRT-08231 with associated crimp pins and housings. 1MM SMD Version SKU: PRT-10208 NOTES ON THE VARIANTS LOCK and LOCK_LONGPADS... This footprint was designed to help hold the alignment of a through-hole component (i.e. 6-pin header) while soldering it into place. You may notice that each hole has been shifted either up or down by 0.005 of an inch from it's more standard position (which is a perfectly straight line). This slight alteration caused the pins (the squares in the middle) to touch the edges of the holes. Because they are alternating, it causes a "brace" to hold the component in place. 0.005 has proven to be the perfect amount of "off-center" position when using our standard breakaway headers. Although looks a little odd when you look at the bare footprint, once you have a header in there, the alteration is very hard to notice. Also,if you push a header all the way into place, it is covered up entirely on the bottom side.; PROD_ID: Combine 8288+14485
J4 J13 = Dual Mono Amp Library:CONN_06: Multi connection point. Often used as Generic Header-pin footprint for 0.1 inch spaced/style header connections On any of the 0.1 inch spaced packages, you can populate with these: Break Away Headers - Straight <https://www.sparkfun.com/products/116> (PRT-00116) Break Away Male Headers - Right Angle <https://www.sparkfun.com/products/553> (PRT-00553) Female Headers <https://www.sparkfun.com/products/115> (PRT-00115) Break Away Headers - Machine Pin <https://www.sparkfun.com/products/117> (PRT-00117) Break Away Female Headers - Swiss Machine Pin <https://www.sparkfun.com/products/743> (PRT-00743) Arduino Stackable Header - 6 Pin <https://www.sparkfun.com/products/9280> (PRT-09280) Screw Terminals 2.54mm Pitch (6-Pin) <https://www.sparkfun.com/products/16499> (PRT-16499) For SCREWTERMINALS and SPRING TERMINALS visit here: Screw Terimnals on SparkFun.com <https://www.sparkfun.com/search/results?term=Screw+Terminals> (5mm/3.5mm/2.54mm spacing) This device is also useful as a general connection point to wire up your design to another part of your project. Our various solder wires solder well into these plated through hole pads. Hook-Up Wire - Assortment (Stranded, 22 AWG) <https://www.sparkfun.com/products/11375> (PRT-11375) Hook-Up Wire - Assortment (Solid Core, 22 AWG) <https://www.sparkfun.com/products/11367> (PRT-11367) View the entire wire category on our website here <https://www.sparkfun.com/categories/141>; PROD_ID: CONN-08437
LDO1-LDO6 = Dual Mono Amp Library:LT3042: LINEAR TECHNOLOGY - LT3042EMSE#PBF - LDO, ADJ, 0.2A, 0V-15V, MSOP-10 Source: Datasheet <http://www.linear.com/docs/46159>; DESCRIPTION: LINEAR TECHNOLOGY - LT3042EMSE#PBF - LDO, ADJ, 0.2A, 0V-15V, MSOP-10; HEIGHT: 1.1mm; MANUFACTURER_NAME: Linear Technology; MANUFACTURER_PART_NUMBER: LT3042EMSE#PBF; MOUSER_PART_NUMBER: 584-LT3042EMSE#PBF; MOUSER_PRICE-STOCK: https://www.mouser.co.uk/ProductDetail/Analog-Devices-Linear-Technology/LT3042EMSEPBF?qs=oahfZPh6IAJ3XP16d20ITw%3D%3D
LDO7 LDO8 = Dual Mono Amp Library:LP5907-1.8V: 250-mA ultra-low-noise low-IQ low-dropout (LDO) linear regulator Source: Datasheet <http://www.ti.com/lit/gpn/lp5907>; ARROW_PART_NUMBER: LP5907MFX-1.8/NOPB; ARROW_PRICE-STOCK: https://www.arrow.com/en/products/lp5907mfx-1.8nopb/texas-instruments?region=nac; DESCRIPTION: 250-mA ultra-low-noise low-IQ low-dropout (LDO) linear regulator; HEIGHT: 1.45mm; MANUFACTURER_NAME: Texas Instruments; MANUFACTURER_PART_NUMBER: LP5907MFX-1.8/NOPB; MOUSER_PART_NUMBER: 595-LP5907MFX-1.8NPB; MOUSER_PRICE-STOCK: https://www.mouser.co.uk/ProductDetail/Texas-Instruments/LP5907MFX-1.8-NOPB?qs=biyDIajrTn5jh5ArkSZeqw%3D%3D
R1A R1B R2A R2B R3A R3B R4A R4B = Dual Mono Amp Library:RT0603DRE075R1L: Thin Film Resistors - SMD 1/10W 5.1 ohm .5% 50ppm Source: Datasheet <https://www.mouser.com/datasheet/2/447/PYu_RT_1_to_0_01_RoHS_L_12-3003070.pdf>; DESCRIPTION: Thin Film Resistors - SMD 1/10W 5.1 ohm .5% 50ppm; HEIGHT: 0.55mm; MANUFACTURER_NAME: YAGEO; MANUFACTURER_PART_NUMBER: RT0603DRE075R1L
R5A = Dual Mono Amp Library:RCS080510K0FKEA: Res Thick Film 0805 10K Ohm 1% 0.4W +/-100ppm/C Pad SMD Automotive T/R Source: Datasheet <https://componentsearchengine.com/Datasheets/1/RCS080510K0FKEA.pdf>; DESCRIPTION: Res Thick Film 0805 10K Ohm 1% 0.4W +/-100ppm/C Pad SMD Automotive T/R; HEIGHT: 0.5mm; MANUFACTURER_NAME: Vishay; MANUFACTURER_PART_NUMBER: RCS080510K0FKEA; MOUSER_PART_NUMBER: 71-RCS080510K0FKEA; MOUSER_PRICE-STOCK: https://www.mouser.com/Search/Refine.aspx?Keyword=71-RCS080510K0FKEA
R6A R6B R6C R6D R6E R6F = Dual Mono Amp Library:CHP0805-FX-1001ELF: BOURNS - CHP0805-FX-1001ELF - SMD Chip Resistor, 0805 [2012 Metric], 1 kohm, CHP Series, 200 V, Thick Film, 500 mW Source: Datasheet <https://www.bourns.com/docs/product-datasheets/chp.pdf>; DESCRIPTION: BOURNS - CHP0805-FX-1001ELF - SMD Chip Resistor, 0805 [2012 Metric], 1 kohm, CHP Series, 200 V, Thick Film, 500 mW; HEIGHT: 0.6mm; MANUFACTURER_NAME: Bourns; MANUFACTURER_PART_NUMBER: CHP0805-FX-1001ELF; MOUSER_PART_NUMBER: 652-CHP0805FX1001ELF; MOUSER_PRICE-STOCK: https://www.mouser.co.uk/ProductDetail/Bourns/CHP0805-FX-1001ELF?qs=lc2O%252BfHJPVYkHmuBCgSoNQ%3D%3D
R7A R7B R7C R7D R7E R7F = Dual Mono Amp Library:CPF0805B51KE1: NEOHM - TE CONNECTIVITY - CPF0805B51KE1 - SMD Chip Resistor, 51 kohm, +/- 0.1%, 100 mW, 0805 [2012 Metric], Thin Film, Precision Low TCR Source: Datasheet; DESCRIPTION: NEOHM - TE CONNECTIVITY - CPF0805B51KE1 - SMD Chip Resistor, 51 kohm, +/- 0.1%, 100 mW, 0805 [2012 Metric], Thin Film, Precision Low TCR; HEIGHT: 0.65mm; MANUFACTURER_NAME: TE Connectivity; MANUFACTURER_PART_NUMBER: CPF0805B51KE1; MOUSER_PART_NUMBER: 279-CPF0805B51KE1; MOUSER_PRICE-STOCK: https://www.mouser.co.uk/ProductDetail/TE-Connectivity-Holsworthy/CPF0805B51KE1?qs=iJVBkmKXgrkfOCLIw017vA%3D%3D
R8A R8B R8C R8D R8E R8F = Dual Mono Amp Library:RR1220P-204-D: RESISTOR, 0805 200 KOhm +/- 0.5% 0.1 W Source: Datasheet <https://componentsearchengine.com/Datasheets/1/RR1220P-204-D.pdf>; DESCRIPTION: RESISTOR, 0805 200 KOhm +/- 0.5% 0.1 W; HEIGHT: mm; MANUFACTURER_NAME: Susumu; MANUFACTURER_PART_NUMBER: RR1220P-204-D; MOUSER_PART_NUMBER: 754-RR1220P-204D; MOUSER_PRICE-STOCK: https://www.mouser.com/Search/Refine.aspx?Keyword=754-RR1220P-204D
R10 R20 = Dual Mono Amp Library:RCS08052K20FKEA: Res Thick Film 0805 2.2K Ohm 1% 0.4W +/-100ppm/C Conformal Coated Pad SMD T/R Source: Datasheet <https://componentsearchengine.com/Datasheets/1/RCS08052K20FKEA.pdf>; DESCRIPTION: Res Thick Film 0805 2.2K Ohm 1% 0.4W +/-100ppm/C Conformal Coated Pad SMD T/R; HEIGHT: mm; MANUFACTURER_NAME: Vishay; MANUFACTURER_PART_NUMBER: RCS08052K20FKEA; MOUSER_PART_NUMBER: 71-RCS08052K20FKEA; MOUSER_PRICE-STOCK: https://www.mouser.com/Search/Refine.aspx?Keyword=71-RCS08052K20FKEA
R21A = Dual Mono Amp Library:R-POL: RESISTOR, American symbol; SPICEPREFIX: R
SH1-SH3 = Dual Mono Amp Library:SHORT: Short between two nets; BOM: No; DESCRIPTION: Short between two nets
SMUTE1 SMUTE2 = Dual Mono Amp Library:SJ: SMD solder JUMPER
TP1-TP6 = testpad:TP: Test pad

## Net classes
3 Power: width 1.27 mm, drill 1.27 mm, clearance 0.254 mm